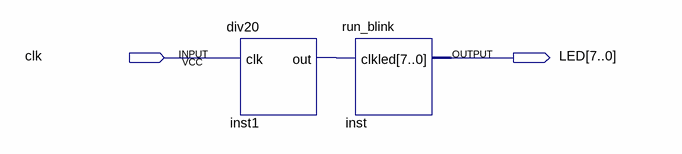
[diagram p0: schematic sheet]
// Quartus schematic run_blink2.bdf as structural Verilog: 2 symbols, 2 pins
module run_blink2 (
  input  clk,
  output [7:0] LED
);

  wire inst1_out;

  div20 inst1 (.clk(clk), .out(inst1_out));
  run_blink inst (.clk(inst1_out), .led(LED));
endmodule
